# Altium project RT1052_MB.PrjPcb
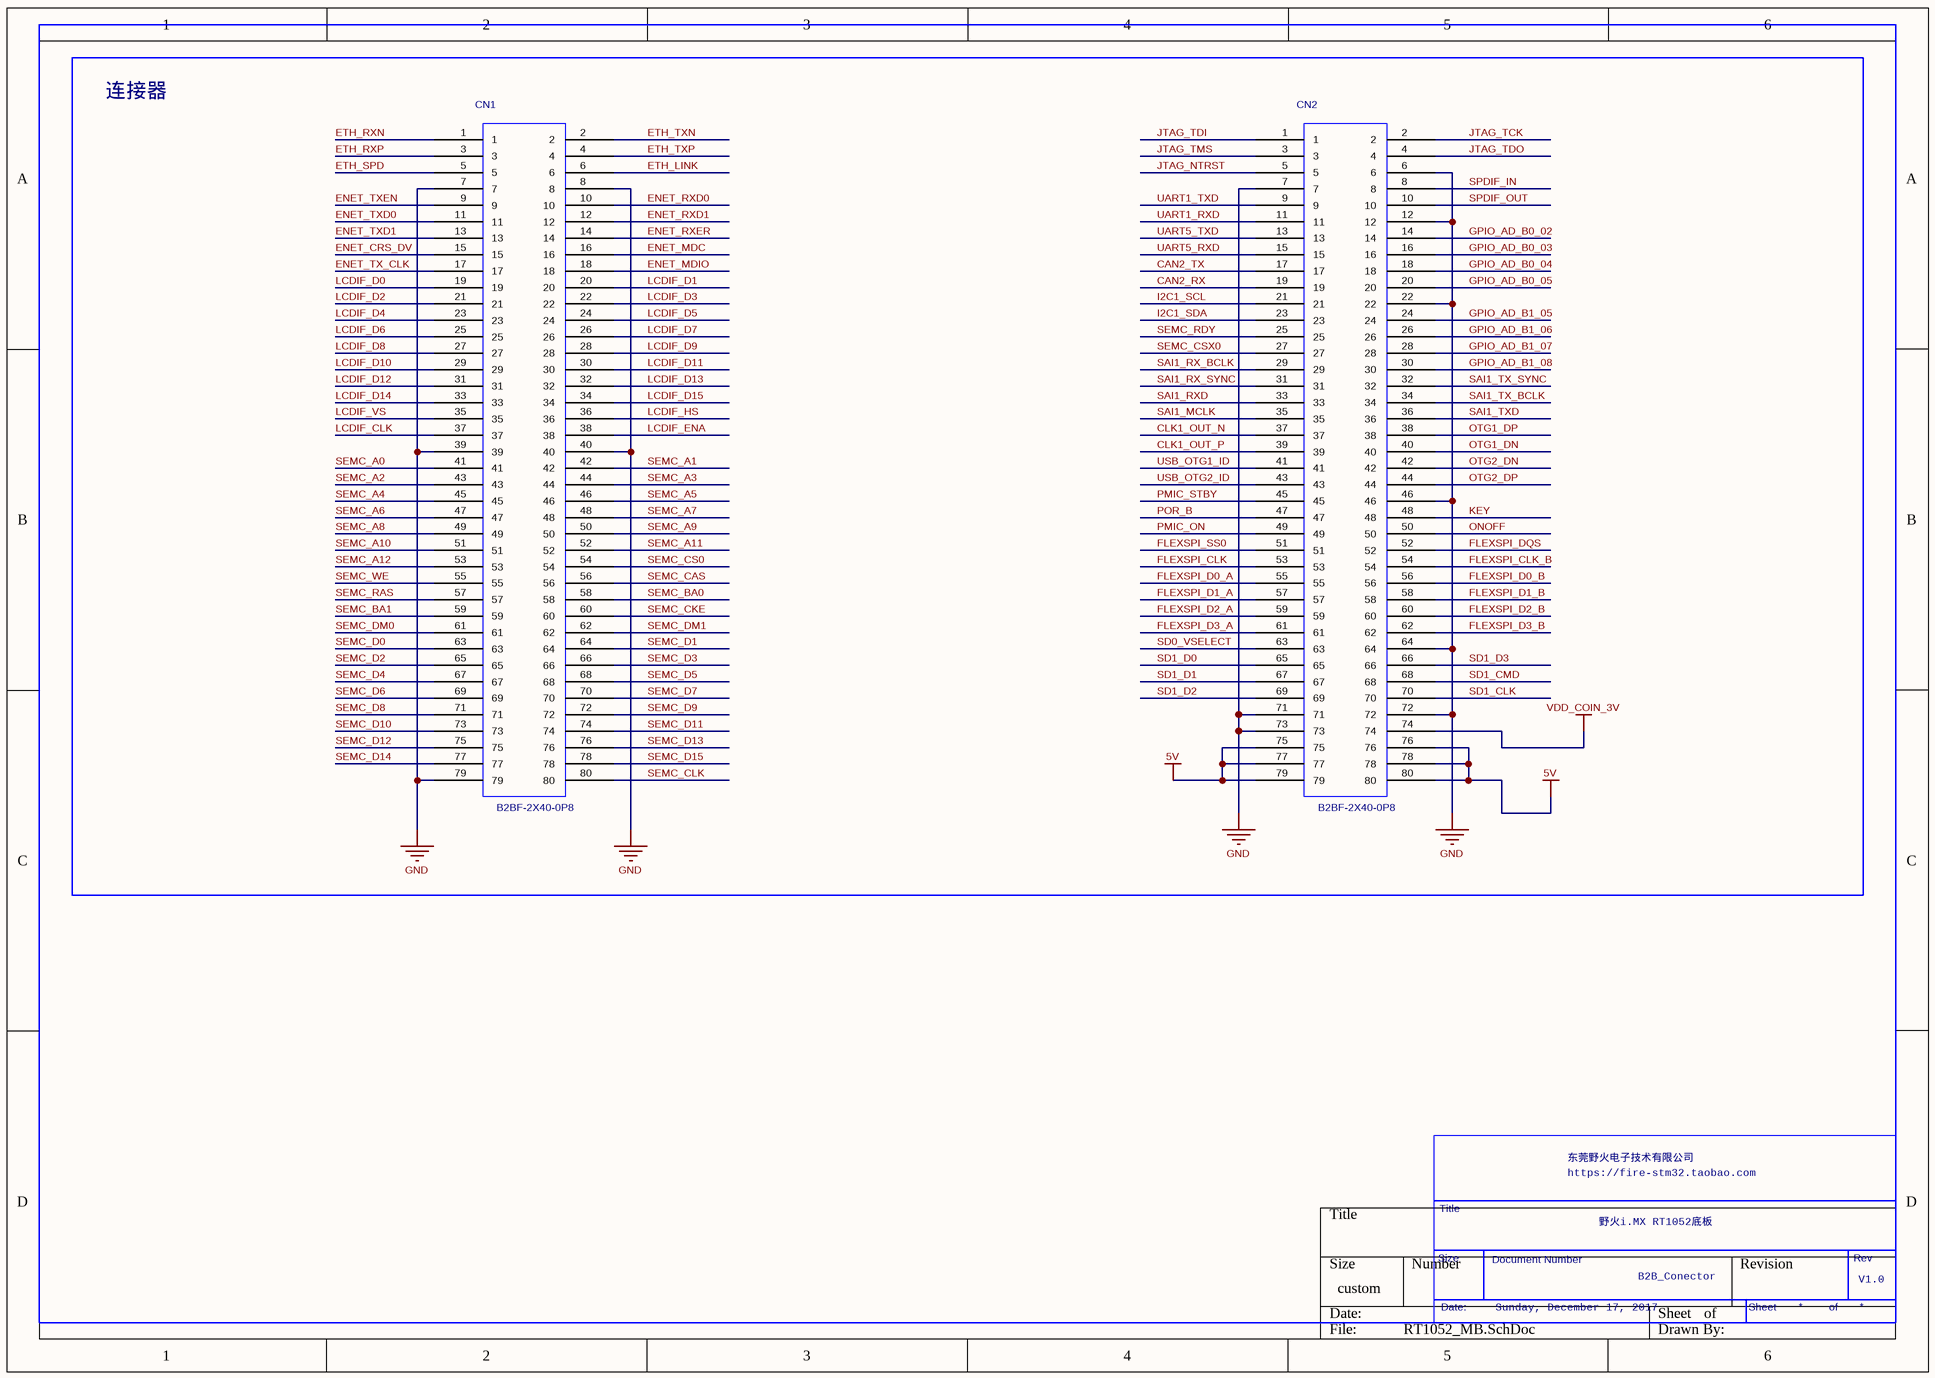
[diagram p0: RT1052_MB.SchDoc]
1 sheet, 2 parts. Net scope: global (net labels, ports and power ports of the same name join across sheets).
Board file: RT1052_MB.PcbDoc

## Sheet RT1052_MB.SchDoc
size 297 x 210 mm

### Parts
CN1  value B2BF-2X40-0P8  [B2BF-2X40-0P8]  (hidden comment: B2B_2X40_0_8MM)
CN2  value B2BF-2X40-0P8  [B2BF-2X40-0P8]  (hidden comment: B2B_2X40_0_8MM)

### Blocks framed on the sheet
连接器: CN1 CN2

### Nets
5V: CN2.75 CN2.76 CN2.77 CN2.78 CN2.79 CN2.80
GND: CN1.7 CN1.8 CN1.39 CN1.40 CN1.79 CN2.6 CN2.7 CN2.12 CN2.22 CN2.46 CN2.64 CN2.71 CN2.72 CN2.73
VDD_COIN_3V: CN2.74
CAN2_RX: CN2.19
CAN2_TX: CN2.17
CLK1_OUT_N: CN2.37
CLK1_OUT_P: CN2.39
ENET_CRS_DV: CN1.15
ENET_MDC: CN1.16
ENET_MDIO: CN1.18
ENET_RXD0: CN1.10
ENET_RXD1: CN1.12
ENET_RXER: CN1.14
ENET_TX_CLK: CN1.17
ENET_TXD0: CN1.11
ENET_TXD1: CN1.13
ENET_TXEN: CN1.9
ETH_LINK: CN1.6
ETH_RXN: CN1.1
ETH_RXP: CN1.3
ETH_SPD: CN1.5
ETH_TXN: CN1.2
ETH_TXP: CN1.4
FLEXSPI_CLK: CN2.53
FLEXSPI_CLK_B: CN2.54
FLEXSPI_D0_A: CN2.55
FLEXSPI_D0_B: CN2.56
FLEXSPI_D1_A: CN2.57
FLEXSPI_D1_B: CN2.58
FLEXSPI_D2_A: CN2.59
FLEXSPI_D2_B: CN2.60
FLEXSPI_D3_A: CN2.61
FLEXSPI_D3_B: CN2.62
FLEXSPI_DQS: CN2.52
FLEXSPI_SS0: CN2.51
GPIO_AD_B0_02: CN2.14
GPIO_AD_B0_03: CN2.16
GPIO_AD_B0_04: CN2.18
GPIO_AD_B0_05: CN2.20
GPIO_AD_B1_05: CN2.24
GPIO_AD_B1_06: CN2.26
GPIO_AD_B1_07: CN2.28
GPIO_AD_B1_08: CN2.30
I2C1_SCL: CN2.21
I2C1_SDA: CN2.23
JTAG_NTRST: CN2.5
JTAG_TCK: CN2.2
JTAG_TDI: CN2.1
JTAG_TDO: CN2.4
JTAG_TMS: CN2.3
KEY: CN2.48
LCDIF_CLK: CN1.37
LCDIF_D0: CN1.19
LCDIF_D1: CN1.20
LCDIF_D2: CN1.21
LCDIF_D3: CN1.22
LCDIF_D4: CN1.23
LCDIF_D5: CN1.24
LCDIF_D6: CN1.25
LCDIF_D7: CN1.26
LCDIF_D8: CN1.27
LCDIF_D9: CN1.28
LCDIF_D10: CN1.29
LCDIF_D11: CN1.30
LCDIF_D12: CN1.31
LCDIF_D13: CN1.32
LCDIF_D14: CN1.33
LCDIF_D15: CN1.34
LCDIF_ENA: CN1.38
LCDIF_HS: CN1.36
LCDIF_VS: CN1.35
ONOFF: CN2.50
OTG1_DN: CN2.40
OTG1_DP: CN2.38
OTG2_DN: CN2.42
OTG2_DP: CN2.44
PMIC_ON: CN2.49
PMIC_STBY: CN2.45
POR_B: CN2.47
SAI1_MCLK: CN2.35
SAI1_RX_BCLK: CN2.29
SAI1_RX_SYNC: CN2.31
SAI1_RXD: CN2.33
SAI1_TX_BCLK: CN2.34
SAI1_TX_SYNC: CN2.32
SAI1_TXD: CN2.36
SD0_VSELECT: CN2.63
SD1_CLK: CN2.70
SD1_CMD: CN2.68
SD1_D0: CN2.65
SD1_D1: CN2.67
SD1_D2: CN2.69
SD1_D3: CN2.66
SEMC_A0: CN1.41
SEMC_A1: CN1.42
SEMC_A2: CN1.43
SEMC_A3: CN1.44
SEMC_A4: CN1.45
SEMC_A5: CN1.46
SEMC_A6: CN1.47
SEMC_A7: CN1.48
SEMC_A8: CN1.49
SEMC_A9: CN1.50
SEMC_A10: CN1.51
SEMC_A11: CN1.52
SEMC_A12: CN1.53
SEMC_BA0: CN1.58
SEMC_BA1: CN1.59
SEMC_CAS: CN1.56
SEMC_CKE: CN1.60
SEMC_CLK: CN1.80
SEMC_CS0: CN1.54
SEMC_CSX0: CN2.27
SEMC_D0: CN1.63
SEMC_D1: CN1.64
SEMC_D2: CN1.65
SEMC_D3: CN1.66
SEMC_D4: CN1.67
SEMC_D5: CN1.68
SEMC_D6: CN1.69
SEMC_D7: CN1.70
SEMC_D8: CN1.71
SEMC_D9: CN1.72
SEMC_D10: CN1.73
SEMC_D11: CN1.74
SEMC_D12: CN1.75
SEMC_D13: CN1.76
SEMC_D14: CN1.77
SEMC_D15: CN1.78
SEMC_DM0: CN1.61
SEMC_DM1: CN1.62
SEMC_RAS: CN1.57
SEMC_RDY: CN2.25
SEMC_WE: CN1.55
SPDIF_IN: CN2.8
SPDIF_OUT: CN2.10
UART1_RXD: CN2.11
UART1_TXD: CN2.9
UART5_RXD: CN2.15
UART5_TXD: CN2.13
USB_OTG1_ID: CN2.41
USB_OTG2_ID: CN2.43

### Notes on the sheet
- 东莞野火电子技术有限公司
- Title
- https://fire-stm32.taobao.com
- 野火i.MX RT1052底板
- Size
- Date:
- Document Number
- Sunday, December 17, 2017
- B2B_Conector
- Sheet
- of
- Rev
- V1.0

### Library data of the parts
CN1 CN2 = B2B_2X40_0_8MM: Source_Path: H:\NXP_RT1050\SCH\SCHLIB\YHSCHLIB.OLB; PCB DECAL: B2BF-2X40-0P8